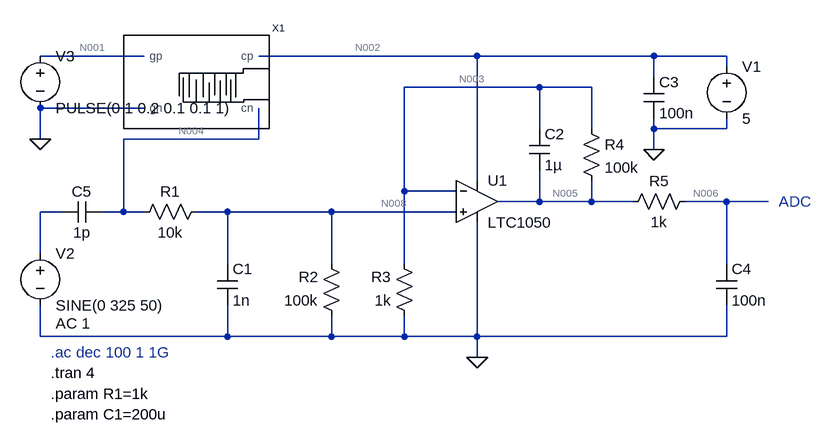
[diagram p0: schematic AIME_3.asc]
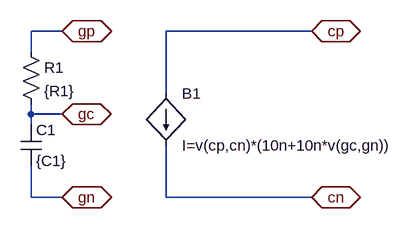
[diagram p1: sub-circuit s_aime.asc]
AIME_3.asc, the LTspice schematic file:
Version 4.1
SHEET 1 984 680
WIRE -64 -160 -224 -160
WIRE 448 -160 112 -160
WIRE 720 -160 448 -160
WIRE 832 -160 720 -160
WIRE 832 -144 832 -160
WIRE 720 -128 720 -160
WIRE 544 -112 336 -112
WIRE 624 -112 544 -112
WIRE -64 -80 -224 -80
WIRE 544 -48 544 -112
WIRE 624 -48 624 -112
WIRE 720 -48 720 -64
WIRE 832 -48 832 -64
WIRE 832 -48 720 -48
WIRE -224 -32 -224 -80
WIRE 112 -32 112 -80
WIRE 112 -32 -96 -32
WIRE 720 -16 720 -48
WIRE 448 32 448 -160
WIRE 336 48 336 -112
WIRE 416 48 336 48
WIRE 544 64 544 16
WIRE 544 64 480 64
WIRE 624 64 624 32
WIRE 624 64 544 64
WIRE 688 64 624 64
WIRE 832 64 768 64
WIRE 896 64 832 64
WIRE -192 80 -224 80
WIRE -96 80 -96 -32
WIRE -96 80 -128 80
WIRE -64 80 -96 80
WIRE 64 80 16 80
WIRE 224 80 64 80
WIRE 416 80 224 80
WIRE -224 144 -224 80
WIRE 64 160 64 80
WIRE 224 160 224 80
WIRE 336 160 336 48
WIRE 832 160 832 64
WIRE -224 272 -224 224
WIRE 64 272 64 224
WIRE 64 272 -224 272
WIRE 224 272 224 240
WIRE 224 272 64 272
WIRE 336 272 336 240
WIRE 336 272 224 272
WIRE 448 272 448 96
WIRE 448 272 336 272
WIRE 832 272 832 224
WIRE 832 272 448 272
WIRE 448 304 448 272
FLAG 448 304 0
FLAG 720 -16 0
FLAG -224 -32 0
SYMBOL OpAmps\\LTC1050 448 0 R0
SYMATTR InstName U1
SYMBOL res 32 64 R90
WINDOW 0 0 56 VBottom 2
WINDOW 3 32 56 VTop 2
SYMATTR InstName R1
SYMATTR Value 10k
SYMBOL res 240 256 R180
WINDOW 0 36 76 Left 2
WINDOW 3 36 40 Left 2
SYMATTR InstName R2
SYMATTR Value 100k
SYMBOL res 352 256 R180
WINDOW 0 36 76 Left 2
WINDOW 3 36 40 Left 2
SYMATTR InstName R3
SYMATTR Value 1k
SYMBOL cap 48 160 R0
SYMATTR InstName C1
SYMATTR Value 1n
SYMBOL cap 528 -48 R0
SYMATTR InstName C2
SYMATTR Value 1µ
SYMBOL res 608 -64 R0
SYMATTR InstName R4
SYMATTR Value 100k
SYMBOL voltage 832 -160 R0
WINDOW 123 0 0 Left 0
WINDOW 39 0 0 Left 0
SYMATTR InstName V1
SYMATTR Value 5
SYMBOL cap 704 -128 R0
SYMATTR InstName C3
SYMATTR Value 100n
SYMBOL res 784 48 R90
WINDOW 0 0 56 VBottom 2
WINDOW 3 32 56 VTop 2
SYMATTR InstName R5
SYMATTR Value 1k
SYMBOL cap 816 160 R0
SYMATTR InstName C4
SYMATTR Value 100n
SYMBOL voltage -224 128 R0
WINDOW 123 24 124 Left 2
WINDOW 39 0 0 Left 0
SYMATTR InstName V2
SYMATTR Value SINE(0 325 50)
SYMATTR Value2 AC 1
SYMBOL cap -128 64 R90
WINDOW 0 0 32 VBottom 2
WINDOW 3 32 32 VTop 2
SYMATTR InstName C5
SYMATTR Value 1p
SYMBOL S_AIME 16 -112 R0
SYMATTR InstName X1
SYMBOL voltage -224 -176 R0
WINDOW 123 0 0 Left 0
WINDOW 39 0 0 Left 0
SYMATTR InstName V3
SYMATTR Value PULSE(0 1 0.2 0.1 0.1 1)
TEXT 912 64 Left 2 ;ADC
TEXT -208 328 Left 2 !.tran 4
TEXT -208 296 Left 2 ;.ac dec 100 1 1G
TEXT -208 360 Left 2 !.param R1=1k
TEXT -208 392 Left 2 !.param C1=200u

s_aime.asc, the sub-circuit schematic file:
Version 4.1
SHEET 1 880 680
WIRE 224 16 176 16
WIRE 608 16 384 16
WIRE 176 48 176 16
WIRE 384 112 384 16
WIRE 176 144 176 128
WIRE 224 144 176 144
WIRE 176 160 176 144
WIRE 176 272 176 224
WIRE 224 272 176 272
WIRE 384 272 384 192
WIRE 608 272 384 272
FLAG 224 16 gp
IOPIN 224 16 BiDir
FLAG 224 272 gn
IOPIN 224 272 BiDir
FLAG 224 144 gc
IOPIN 224 144 BiDir
FLAG 608 16 cp
IOPIN 608 16 BiDir
FLAG 608 272 cn
IOPIN 608 272 BiDir
SYMBOL cap 160 160 R0
SYMATTR InstName C1
SYMATTR Value {C1}
SYMBOL res 160 32 R0
SYMATTR InstName R1
SYMATTR Value {R1}
SYMBOL bi 384 112 R0
SYMATTR InstName B1
SYMATTR Value I=v(cp,cn)*(10n+10n*v(gc,gn))

The netlist it stands for:
* AIME_3.asc
X§U1 N008 N003 N002 0 N005 LTC1050  ; pins In+ In- V+ V- OUT
R1 N008 N004 10k
R2 0 N008 100k
R3 0 N003 1k
C1 N008 0 1n
C2 N003 N005 1µ
R4 N003 N005 100k
V1 N002 0 5
C3 N002 0 100n
R5 N006 N005 1k
C4 N006 0 100n
V2 N007 0 SINE(0 325 50) AC 1
C5 N004 N007 1p
X§X1 N001 0 N002 N004 s_aime
V3 N001 0 PULSE(0 1 0.2 0.1 0.1 1)

* block symbol definitions
.subckt s_aime gp gn cp cn
C1 gc gn {C1}
R1 gp gc {R1}
B1 cp cn I=v(cp,cn)*(10n+10n*v(gc,gn))
.ends s_aime

* ADC
.tran 4
* .ac dec 100 1 1G
.param R1=1k
.param C1=200u
.lib LTC.lib
.backanno
.end

* Results of the author's LTspice run, read from the files saved beside the schematic
* Operating Point, zero values left out:
*   V(n002) = 5 V
*   V(n003) = 4.995 mV
*   V(n004) = 5.494 mV
*   V(n005) = 504.4 mV
*   V(n006) = 504.4 mV
*   V(n008) = 4.995 mV
*   I(R1) = -49.95 nA
*   I(R2) = -49.95 nA
*   I(R3) = -4.995 µA
*   I(R4) = -4.995 µA
*   I(V1) = -754.2 µA
*   Ix(u1:3) = 754.1 µA
*   Ix(u1:4) = -749.1 µA
*   Ix(u1:5) = -4.995 µA
*   Ix(x1:cn) = -49.95 nA
*   Ix(x1:cp) = 49.95 nA
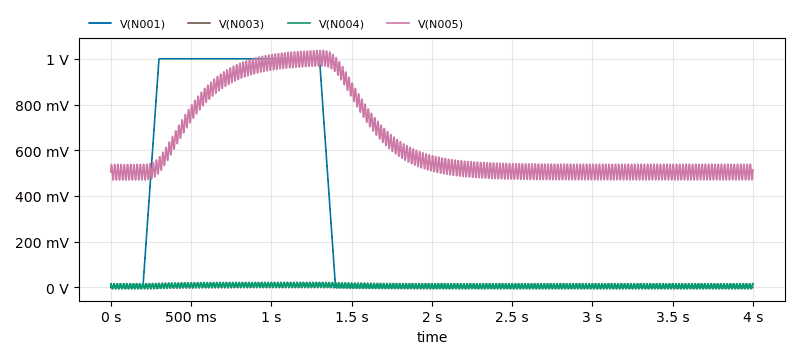
[diagram p2: Transient Analysis of AIME_3.asc, plotted from the saved traces]
* Transient Analysis, 1 run:
*   V(N001): min 0 V, max 1 V, average 275 mV, rms 516.4 mV, last 0 V
*   V(N003): min -5.353 mV, max 20.26 mV, average 6.365 mV, rms 9.864 mV, last 15.15 mV
*   V(N004): min -6.01 mV, max 22.4 mV, average 7.002 mV, rms 10.85 mV, last 16.53 mV
*   V(N005): min 469.5 mV, max 1.037 V, average 642.9 mV, rms 670.5 mV, last 514.6 mV